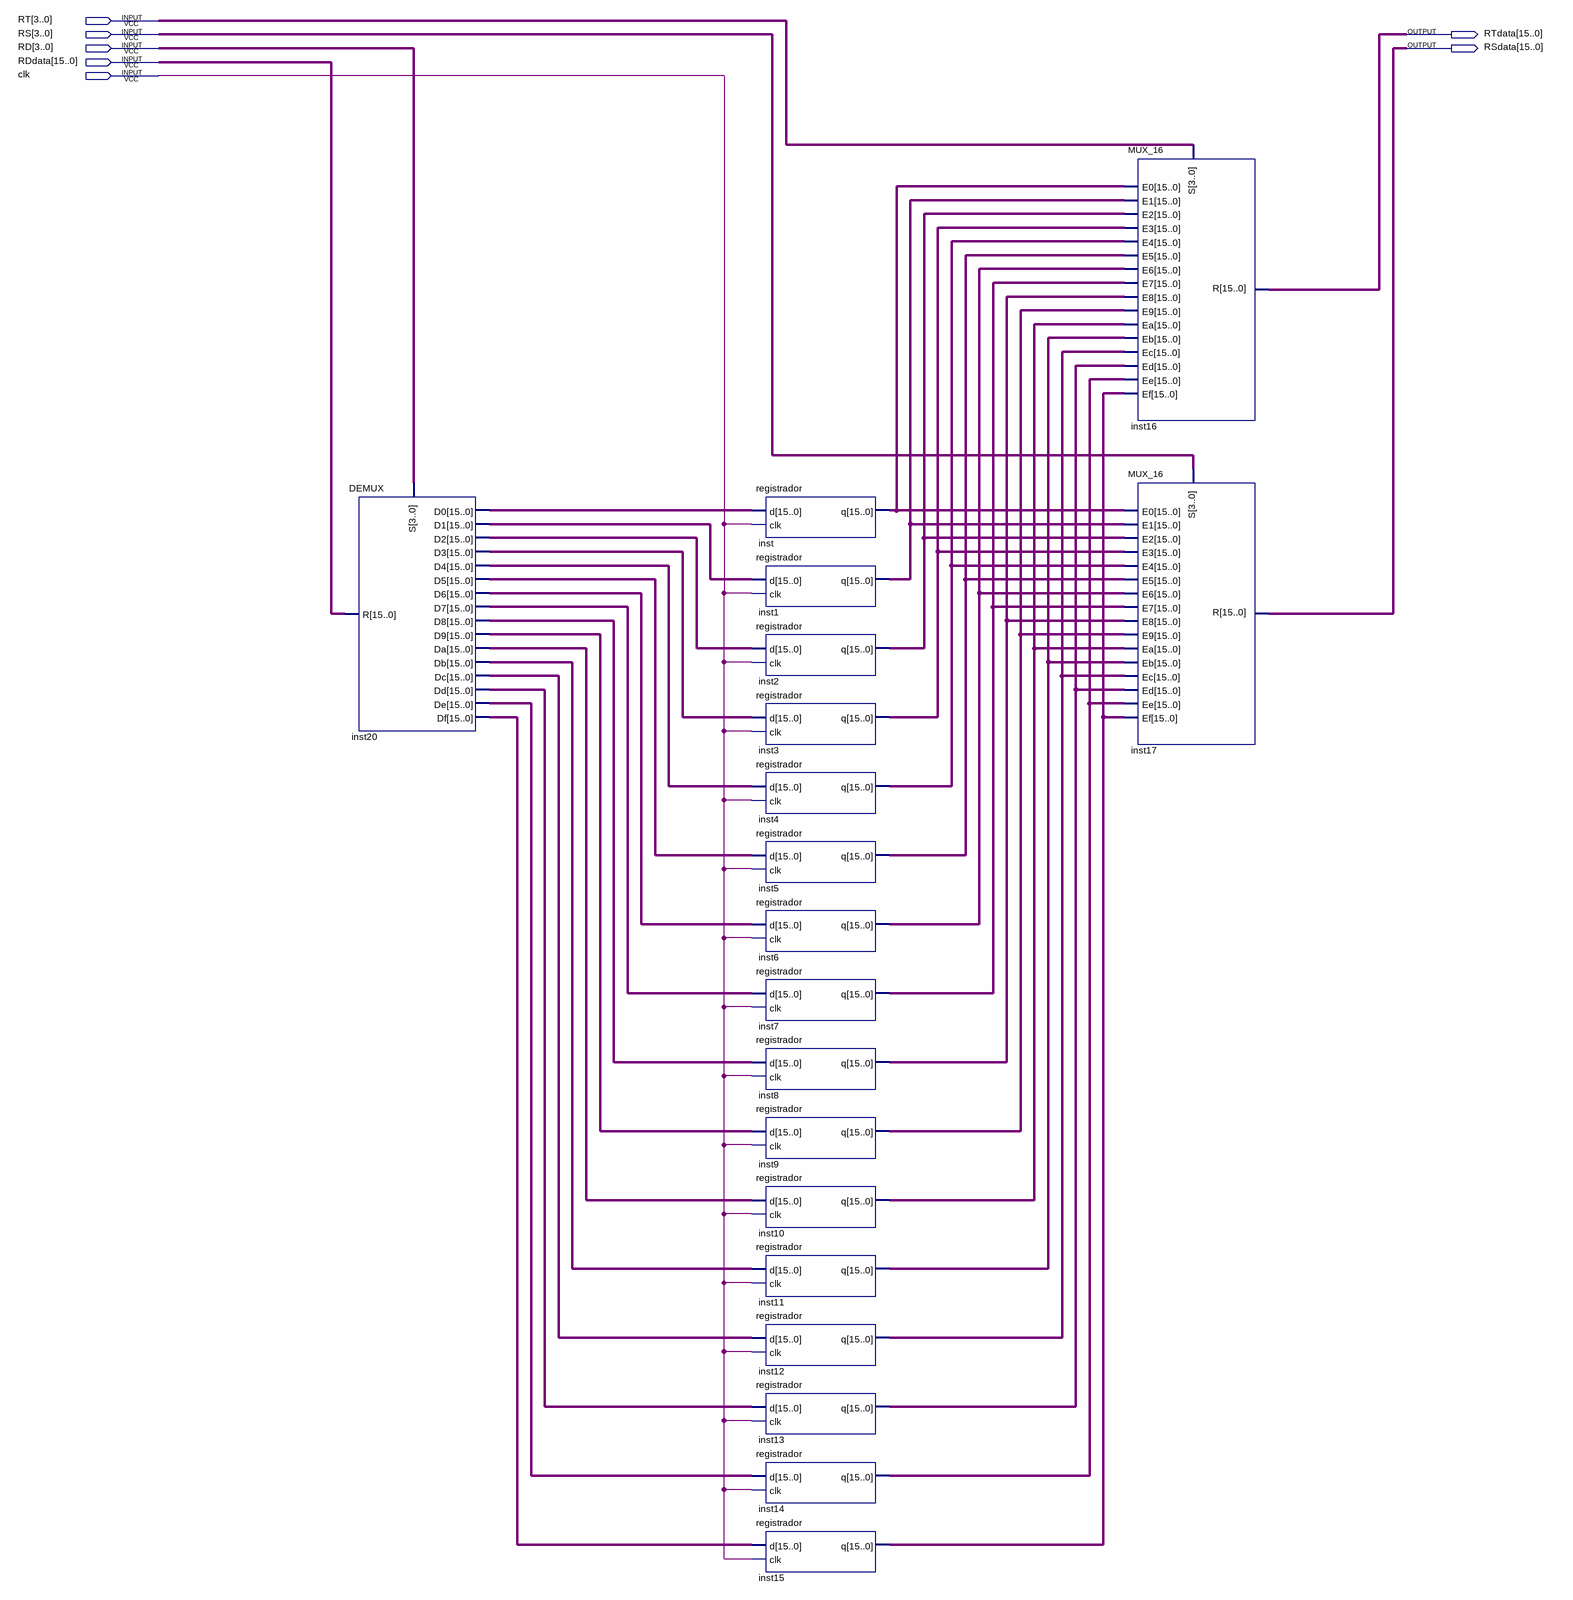
[diagram p0: schematic sheet]
// Quartus schematic bancoDeRegistradores.bdf as structural Verilog: 19 symbols, 7 pins
module bancoDeRegistradores (
  input  [3:0] RT,
  input  [3:0] RS,
  input  [3:0] RD,
  input  [15:0] RDdata,
  input  clk,
  output [15:0] RTdata,
  output [15:0] RSdata
);

  wire [15:0] inst1_q, inst2_q, inst3_q, inst4_q, inst5_q, inst6_q, inst7_q, inst8_q, inst9_q, inst10_q,
       inst11_q, inst12_q, inst13_q, inst14_q, inst15_q, inst20_d0, inst20_d1, inst20_d2, inst20_d3,
       inst20_d4, inst20_d5, inst20_d6, inst20_d7, inst20_d8, inst20_d9, inst20_da, inst20_db, inst20_dc,
       inst20_dd, inst20_de, inst20_df, inst_q;

  DEMUX inst20 (
    .S(RD), .R(RDdata), .D0(inst20_d0), .D1(inst20_d1), .D2(inst20_d2), .D3(inst20_d3), .D4(inst20_d4),
    .D5(inst20_d5), .D6(inst20_d6), .D7(inst20_d7), .D8(inst20_d8), .D9(inst20_d9), .Da(inst20_da),
    .Db(inst20_db), .Dc(inst20_dc), .Dd(inst20_dd), .De(inst20_de), .Df(inst20_df));
  registrador inst (.d(inst20_d0), .clk(clk), .q(inst_q));
  registrador inst1 (.d(inst20_d1), .clk(clk), .q(inst1_q));
  registrador inst2 (.d(inst20_d2), .clk(clk), .q(inst2_q));
  registrador inst3 (.d(inst20_d3), .clk(clk), .q(inst3_q));
  registrador inst4 (.d(inst20_d4), .clk(clk), .q(inst4_q));
  registrador inst5 (.d(inst20_d5), .clk(clk), .q(inst5_q));
  registrador inst6 (.d(inst20_d6), .clk(clk), .q(inst6_q));
  registrador inst7 (.d(inst20_d7), .clk(clk), .q(inst7_q));
  registrador inst8 (.d(inst20_d8), .clk(clk), .q(inst8_q));
  registrador inst9 (.d(inst20_d9), .clk(clk), .q(inst9_q));
  registrador inst10 (.d(inst20_da), .clk(clk), .q(inst10_q));
  registrador inst11 (.d(inst20_db), .clk(clk), .q(inst11_q));
  registrador inst12 (.d(inst20_dc), .clk(clk), .q(inst12_q));
  registrador inst13 (.d(inst20_dd), .clk(clk), .q(inst13_q));
  registrador inst14 (.d(inst20_de), .clk(clk), .q(inst14_q));
  registrador inst15 (.d(inst20_df), .clk(clk), .q(inst15_q));
  MUX_16 inst16 (
    .S(RT), .E0(inst_q), .E1(inst1_q), .E2(inst2_q), .E3(inst3_q), .E4(inst4_q), .E5(inst5_q), .E6(inst6_q),
    .E7(inst7_q), .E8(inst8_q), .E9(inst9_q), .Ea(inst10_q), .Eb(inst11_q), .Ec(inst12_q), .Ed(inst13_q),
    .Ee(inst14_q), .Ef(inst15_q), .R(RTdata));
  MUX_16 inst17 (
    .S(RS), .E0(inst_q), .E1(inst1_q), .E2(inst2_q), .E3(inst3_q), .E4(inst4_q), .E5(inst5_q), .E6(inst6_q),
    .E7(inst7_q), .E8(inst8_q), .E9(inst9_q), .Ea(inst10_q), .Eb(inst11_q), .Ec(inst12_q), .Ed(inst13_q),
    .Ee(inst14_q), .Ef(inst15_q), .R(RSdata));
endmodule
